# EAGLE design LibreServo-v2.3.1 (EAGLE 7.6.0)
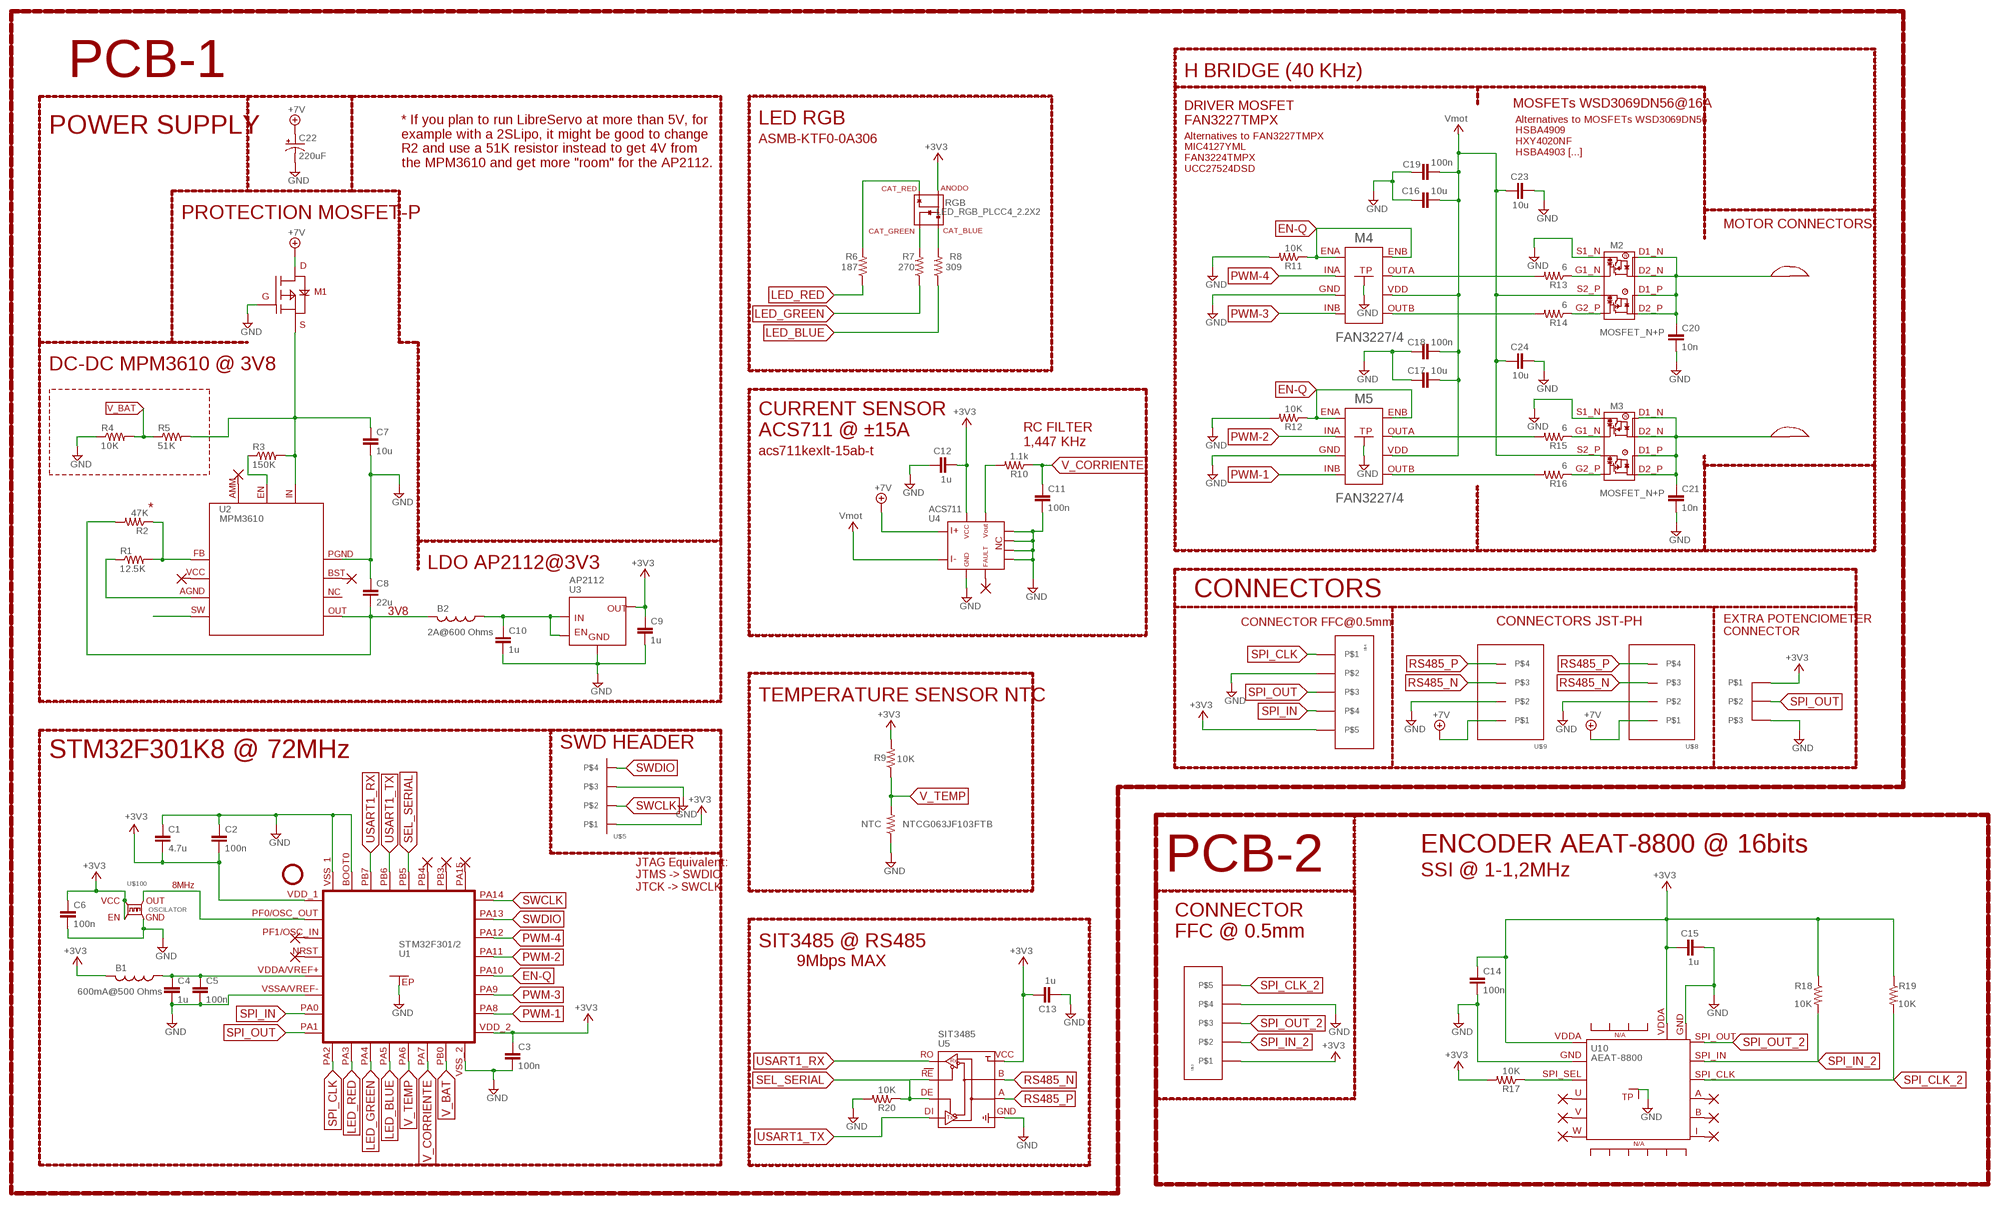
[diagram p0: schematic, sheet 1]

## Parts
B1  FERRITE_BEAD_0402  [0402]
B2  FERRITE_BEAD_0603  [0603]
C1  4.7u  C-EU0402  [0402]
C2  100n  C-EU0402  [0402]
C3  100n  C-EU0402  [0402]
C4  1u  C-EU0402  [0402]
C5  100n  C-EU0402  [0402]
C6  100n  C-EU0402  [0402]
C7  10u  C-EU0603  [0603]
C8  22u  C-EU1206  [1206]
C9  1u  C-EU0402  [0402]
C10  1u  C-EU0402  [0402]
C11  100n  C-EU0402  [0402]
C12  1u  C-EU0402  [0402]
C13  1u  C-EU0402  [0402]
C14  100n  C-EU0402  [0402]
C15  1u  C-EU0402  [0402]
C16  10u  C-EU0603  [0603]
C17  10u  C-EU0603  [0603]
C18  100n  C-EU0402  [0402]
C19  100n  C-EU0402  [0402]
C20  10n  C-EU0402  [0402]
C21  10n  C-EU0402  [0402]
C22  220uF  CPOL-USE2,5-6_MIN  [E2,5-6_MIN]
C23  10u  C-EU0603  [0603]
C24  10u  C-EU0603  [0603]
M1  M1  P5103EMA  [SOT23]
M2  MOSFET_N+P  [DFN5X6]
M3  MOSFET_N+P  [DFN5X6]
M4  FAN3227/4  FAN3227/3  [MLP8]
M5  FAN3227/4  FAN3227/3  [MLP8]
NTC  R-US0402_MIN  [0402_MIN]
R1  12.5K  R-US0402  [0402]
R2  47K  R-US0402  [0402]
R3  150K  R-US0402  [0402]
R4  10K  R-US0402  [0402]
R5  51K  R-US0402  [0402]
R6  187  R-US0402  [0402]
R7  270  R-US0402  [0402]
R8  309  R-US0402  [0402]
R9  10K  R-US0402  [0402]
R10  1.1k  R-US0402  [0402]
R11  10K  R-US0402  [0402]
R12  10K  R-US0402  [0402]
R13  6  R-US0402  [0402]
R14  6  R-US0402  [0402]
R15  6  R-US0402  [0402]
R16  6  R-US0402  [0402]
R17  10K  R-US0402  [0402]
R18  10K  R-US0402  [0402]
R19  10K  R-US0402  [0402]
R20  10K  R-US0402  [0402]
RGB  LED_RGB_PLCC4_2.2X2  [PLCC-4_2.2X2]
U1  STM32F301/2  STM32F302  [QFN32]
U2  MPM3610  MPM36XX  [MPM36XX]
U3  AP2112  [SOT25]
U4  ACS711  [ACS711-QFN]
U5  SIT3485  RS485-HALF_DUPLEX  [MSOP-8]
U10  AEAT-8800  [QFN24]
U$1  SLOT  [SERVO_SLOT]
U$2  SLOT  [SERVO_SLOT]
U$3  FFC-5  [FFC-5-0.5]
U$4  FFC-5  [FFC-5-0.5]
U$5  HEADER_4_1.27_0.3  [HEADER_4_1.27_0.3]
U$6  POTEN_SERVO  [POTEN_SERVO]
U$7  NC_MARKER  (no package)
U$8  JST_PH-4_HOLEB  [JST_PH-4_HOLE_B]
U$9  JST_PH-4_HOLEB  [JST_PH-4_HOLE_B]
U$10  NC_MARKER  (no package)
U$11  NC_MARKER  (no package)
U$12  NC_MARKER  (no package)
U$13  NC_MARKER  (no package)
U$14  NC_MARKER  (no package)
U$15  NC_MARKER  (no package)
U$16  NC_MARKER  (no package)
U$17  NC_MARKER  (no package)
U$18  NC_MARKER  (no package)
U$19  NC_MARKER  (no package)
U$20  NC_MARKER  (no package)
U$21  NC_MARKER  (no package)
U$22  NC_MARKER  (no package)
U$23  NC_MARKER  (no package)
U$100  OSCILATOR  [OSC-2X1.6]

## Nets
711_OUT: R10.2 U4.P$11
+3V3: B1.2 C1.2 C2.2 C3.1 C6.1 C9.1 C12.2 C13.2 R9.2 RGB.P$1(ANODO) U1.1(VDD_1) U1.17(VDD_2) U3.5 U4.P$12 U5.P$8 U$4.P$5 U$5.P$1 U$6.P$1 U$100.P$1(EN) U$100.P$4(VCC)
+3V3_2: C14.1 C15.1 R17.2 R18.1 R19.1 U10.P$14 U10.P$19 U$3.P$1 ; supply symbol labelled +3V3
+7V: C22.+ M1.P$2(D) U4.P$1 U$8.P$1 U$9.P$1
CLK-8MHZ: U1.2(PF0/OSC_IN) U$100.P$3(OUT)
EN-Q: M4.P$1(ENA) M4.P$8(ENB) M5.P$1(ENA) M5.P$8(ENB) R11.1 R12.1 U1.20(PA10)
GND: C1.1 C2.1 C3.2 C4.2 C5.2 C6.2 C7.2 C8.1 C9.2 C10.2 C11.2 C12.1 C13.1 C16.1 C17.1 C18.1 C19.1 C20.2 C21.2 C22.- C23.2 C24.2 M1.P$1(G) M2.P$1(S1_N) M3.P$1(S1_N) M4.P$3(GND) M4.P$9(TP) M5.P$3(GND) M5.P$9(TP) NTC.1 R4.1 R11.2 R12.2 R20.2 U1.6(VSSA/VREF-) U1.16(VSS_2) U1.31(BOOT0) U1.32(VSS_1) U1.EP U2.P$12(P$8_PGND) U2.P$13(P$8_PGND) U2.P$14(P$8_PGND) U3.2 U4.P$5 U4.P$7 U4.P$8 U4.P$9 U4.P$10 U5.P$5 U$4.P$2 U$5.P$3 U$6.P$3 U$8.P$2 U$9.P$2 U$100.P$2(GND)
GND_2: C14.2 C15.2 U10.P$13 U10.P$20 U10.P$25 U$3.P$4 ; supply symbol labelled GND
IN_AP2112: B2.1 C10.1 U3.1 U3.3
LED_BLUE: R8.1 U1.12(PA5)
LED_GREEN: R7.1 U1.11(PA4)
LED_RED: R6.1 U1.10(PA3)
M1-OUT: C7.1 M1.P$3(S) R3.2 R5.2 U2.P$16(P$9_IN)
M2-OUT: C20.1 M2.P$5(D2_P) M2.P$6(D1_P) M2.P$7(D2_N) M2.P$8(D1_N) M2.P$9(D1_N) U$1.P$1
M3-OUT: C21.1 M3.P$5(D2_P) M3.P$6(D1_P) M3.P$7(D2_N) M3.P$8(D1_N) M3.P$9(D1_N) U$2.P$1
M4-OUTA: M4.P$7(OUTA) R13.2
M4-OUTA-IN: M2.P$2(G1_N) R13.1
M4-OUTB: M4.P$5(OUTB) R14.2
M4-OUTB-IN: M2.P$4(G2_P) R14.1
M5-OUTA: M5.P$7(OUTA) R15.2
M5-OUTA-IN: M3.P$2(G1_N) R15.1
M5-OUTB: M5.P$5(OUTB) R16.2
M5-OUTB-IN: M3.P$4(G2_P) R16.1
MPM3610_AGND: R1.1 U2.P$3(P$3_AGND)
MPM3610_EN: R3.1 U2.P$17(P$10_EN)
MPM3610_FB: R1.2 R2.1 U2.P$1(P$1_FB)
MPM3610_SW: U2.P$4(P$4_SW) U2.P$5(P$4_SW) U2.P$6(P$4_SW)
N$1: R6.2 RGB.P$4(CAT_RED)
N$2: U2.P$2(P$2_VCC) U$7.P$1
N$3: U2.P$18(P$11_AMM) U$10.P$1
N$4: R7.2 RGB.P$3(CAT_GREEN)
N$5: R8.2 RGB.P$2(CAT_BLUE)
N$6: U2.P$11(P$7_BST) U$11.P$1
N$7: U1.27(PB4) U$12.P$1
N$8: U1.26(PB3) U$13.P$1
N$9: U1.25(PA15) U$14.P$1
N$10: U1.3(PF1/OSC_OUT) U$15.P$1
N$11: U1.4(NRST) U$16.P$1
N$12: U10.P$22 U$17.P$1
N$13: U10.P$23 U$18.P$1
N$14: U10.P$24 U$19.P$1
N$15: U10.P$7 U$20.P$1
N$16: U10.P$8 U$21.P$1
N$17: R17.1 U10.P$21
N$18: U10.P$9 U$22.P$1
N$19: U4.P$6 U$23.P$1
OUT_MPM3610: B2.2 C8.2 R2.2 U2.P$7(P$5_OUT) U2.P$8(P$5_OUT) U2.P$9(P$5_OUT)
PWM-1: M5.P$4(INB) U1.18(PA8)
PWM-2: M5.P$2(INA) U1.21(PA11)
PWM-3: M4.P$4(INB) U1.19(PA9)
PWM-4: M4.P$2(INA) U1.22(PA12)
RS485_N [Diff]: U5.P$7 U$8.P$3 U$9.P$3
RS485_P [Diff]: U5.P$6 U$8.P$4 U$9.P$4
SEL_SERIAL: R20.1 U1.28(PB5) U5.P$2 U5.P$3
SPI_CLK: U1.9(PA2) U$4.P$1
SPI_CLK_2: R19.2 U10.P$10 U$3.P$5
SPI_IN: U1.7(PA0) U$4.P$4
SPI_IN_2: R18.2 U10.P$11 U$3.P$2
SPI_OUT: U1.8(PA1) U$4.P$3 U$6.P$2
SPI_OUT_2: U10.P$12 U$3.P$3
SWCLK: U1.24(PA14) U$5.P$2
SWDIO: U1.23(PA13) U$5.P$4
USART1_RX: U1.30(PB7) U5.P$1
USART1_TX: U1.29(PB6) U5.P$4
V_BAT: R4.2 R5.1 U1.15(PB0)
V_CORRIENTE: C11.1 R10.1 U1.14(PA7)
V_TEMP: NTC.2 R9.1 U1.13(PA6)
VDDA-FILTRADO: B1.1 C4.1 C5.1 U1.5(VDDA/VREF+)
VMOT: C16.2 C17.2 C18.2 C19.2 C23.1 C24.1 M2.P$3(S2_P) M3.P$3(S2_P) M4.P$6(VDD) M5.P$6(VDD) U4.P$3 ; supply symbol labelled Vmot
Unconnected: U2.P$10(P$6_NC) U2.P$15(P$6_NC) U10.P$1 U10.P$2 U10.P$3 U10.P$4 U10.P$5 U10.P$6 U10.P$15 U10.P$16 U10.P$17 U10.P$18 U$1.P$2 U$2.P$2

## Notes on the sheet
- PCB-1 | H BRIDGE (40 KHz)
- MOSFETs WSD3069DN56@16A
- LED RGB
- DRIVER MOSFET
  FAN3227TMPX
- POWER SUPPLY
- ASMB-KTF0-0A306
- Alternatives to MOSFETs WSD3069DN56
  HSBA4909
  HXY4020NF
  HSBA4903 [...]
- * If you plan to run LibreServo at more than 5V, for
  example with a 2SLipo, it might be good to change
  R2 and use a 51K resistor instead to get 4V from
  the MPM3610 and get more "room" for the AP2112.
- Alternatives to FAN3227TMPX
  MIC4127YML
  FAN3224TMPX
  UCC27524DSD
- PROTECTION MOSFET-P
- MOTOR CONNECTORS
- M1
- DC-DC MPM3610 @ 3V8
- CURRENT SENSOR
  ACS711 @ ±15A
- RC FILTER
  1,447 KHz
- acs711kexlt-15ab-t
- *
- LDO AP2112@3V3
- CONNECTORS
- 3V8
- CONNECTOR FFC@0.5mm | CONNECTORS JST-PH
- 2A@600 Ohms
- EXTRA POTENCIOMETER
  CONNECTOR
- TEMPERATURE SENSOR NTC
- SWD HEADER
- STM32F301K8 @ 72MHz
- NTCG063JF103FTB
- ENCODER AEAT-8800 @ 16bits
- PCB-2 | SSI @ 1-1,2MHz
- 8MHz
- JTAG Equivalent:
  JTMS -> SWDIO
  JTCK -> SWCLK
- CONNECTOR
  FFC @ 0.5mm
- SIT3485 @ RS485
- 9Mbps MAX
- 600mA@500 Ohms

## Library data of the parts
B1 = Propio:FERRITE_BEAD_0402
B2 = Propio:FERRITE_BEAD_0603
C1-C21 C23 C24 = Propio:C-EU
C22 = rcl:CPOL-US: POLARIZED CAPACITOR, American symbol
M1 = Propio:P5103EMA
M2 M3 = Propio:MOSFET_N+P
M4 M5 = Propio:FAN3227/3
NTC R1-R20 = Propio:R-US
RGB = Propio:LED_RGB_PLCC4_2.2X2
U1 = Propio:STM32F302
U2 = Propio:MPM36XX
U3 = Propio:AP2112
U4 = Propio:ACS711
U5 = Propio:RS485-HALF_DUPLEX
U10 = Propio:AEAT-8800
U$1 U$2 = Propio:SLOT
U$3 U$4 = Propio:FFC-5
U$5 = Propio:HEADER_4
U$6 = Propio:POTEN_SERVO
U$7 U$10-U$23 = NC_MARKER:NC_MARKER
U$8 U$9 = Propio:JST_PH-4_HOLE
U$100 = Propio:OSCILATOR

## Net classes
1 Diff: width 0.178 mm, clearance 0.152 mm

## Board
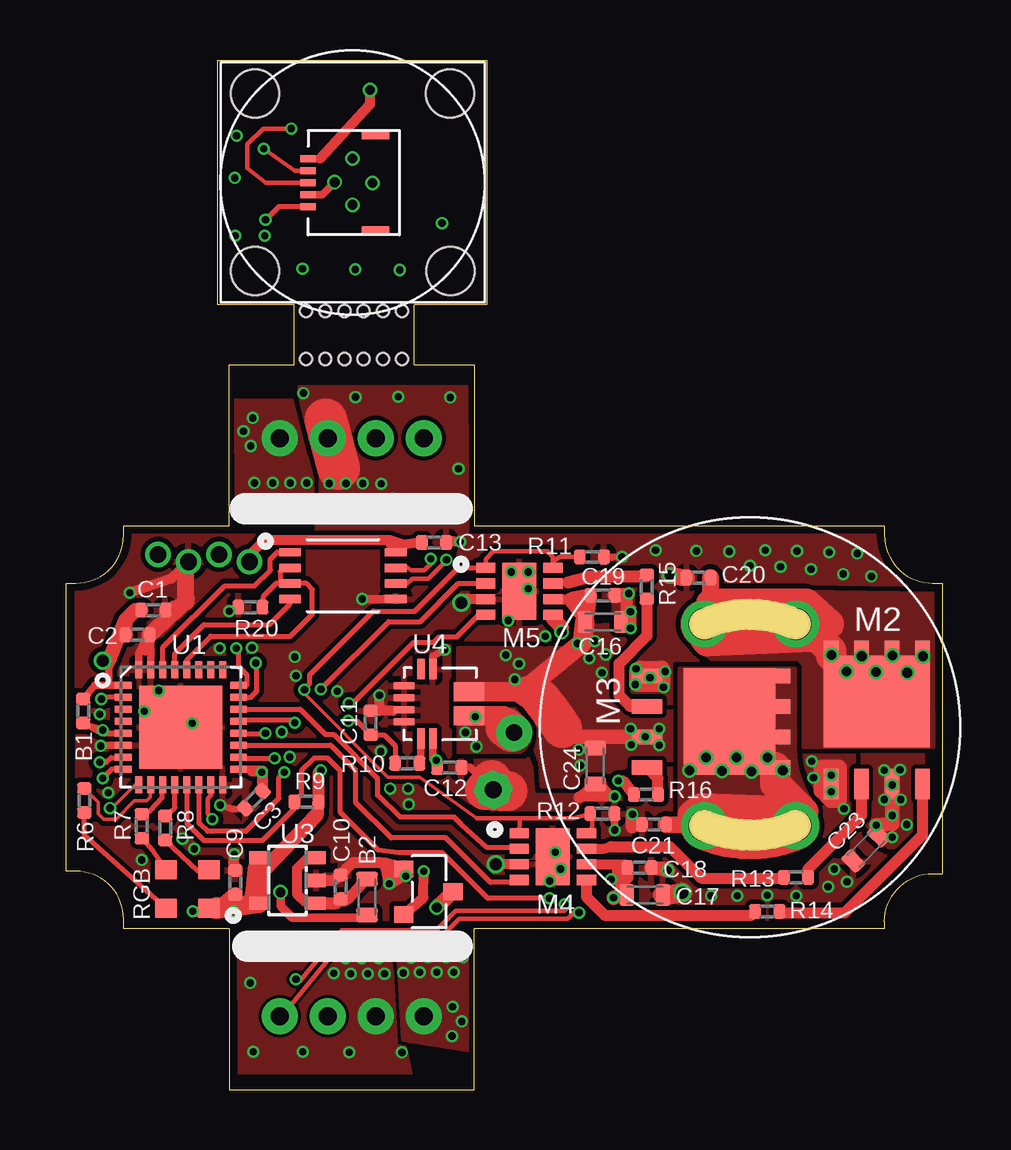
[diagram p1: board, top side]
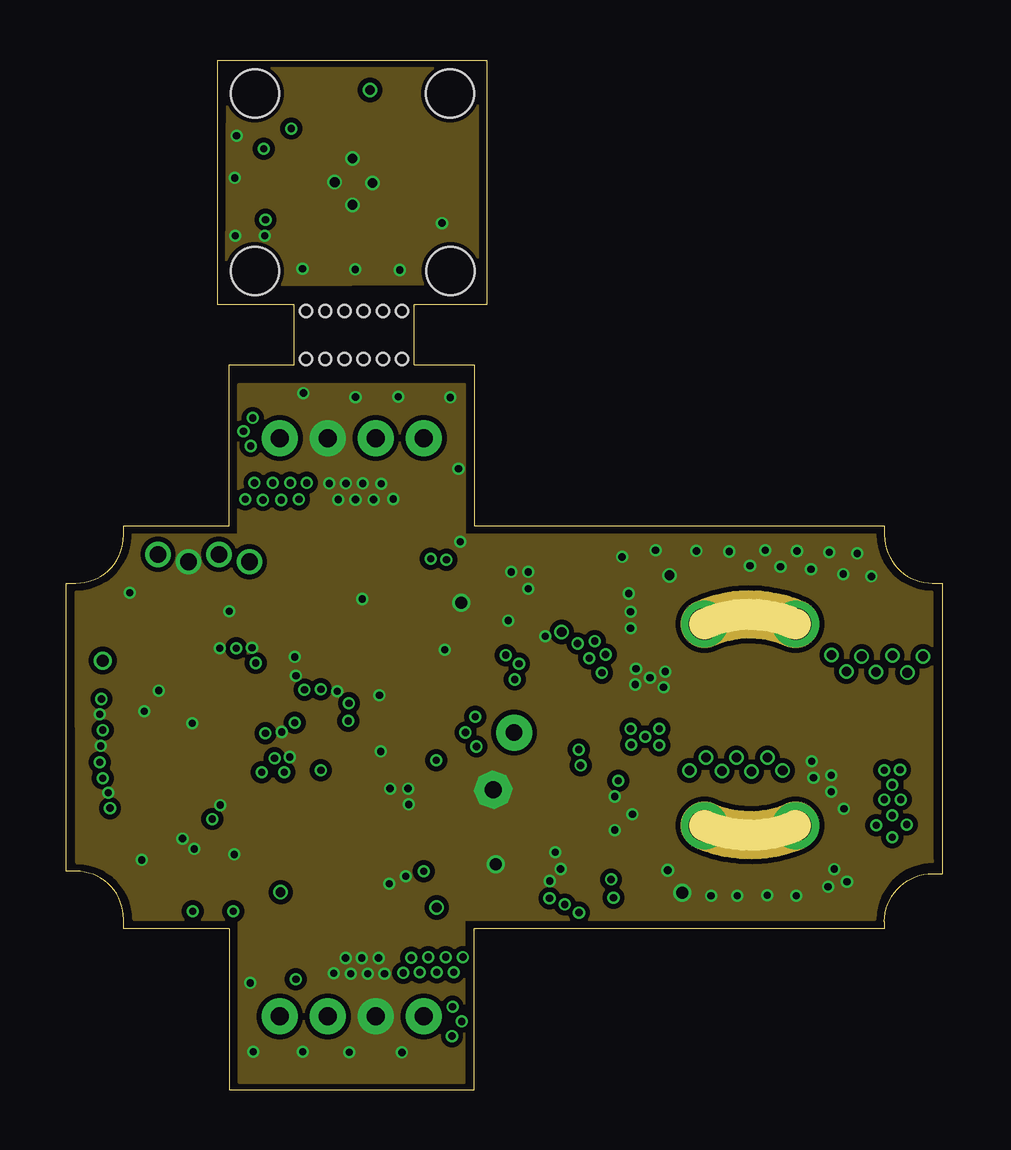
[diagram p2: board, inner layer Route2]
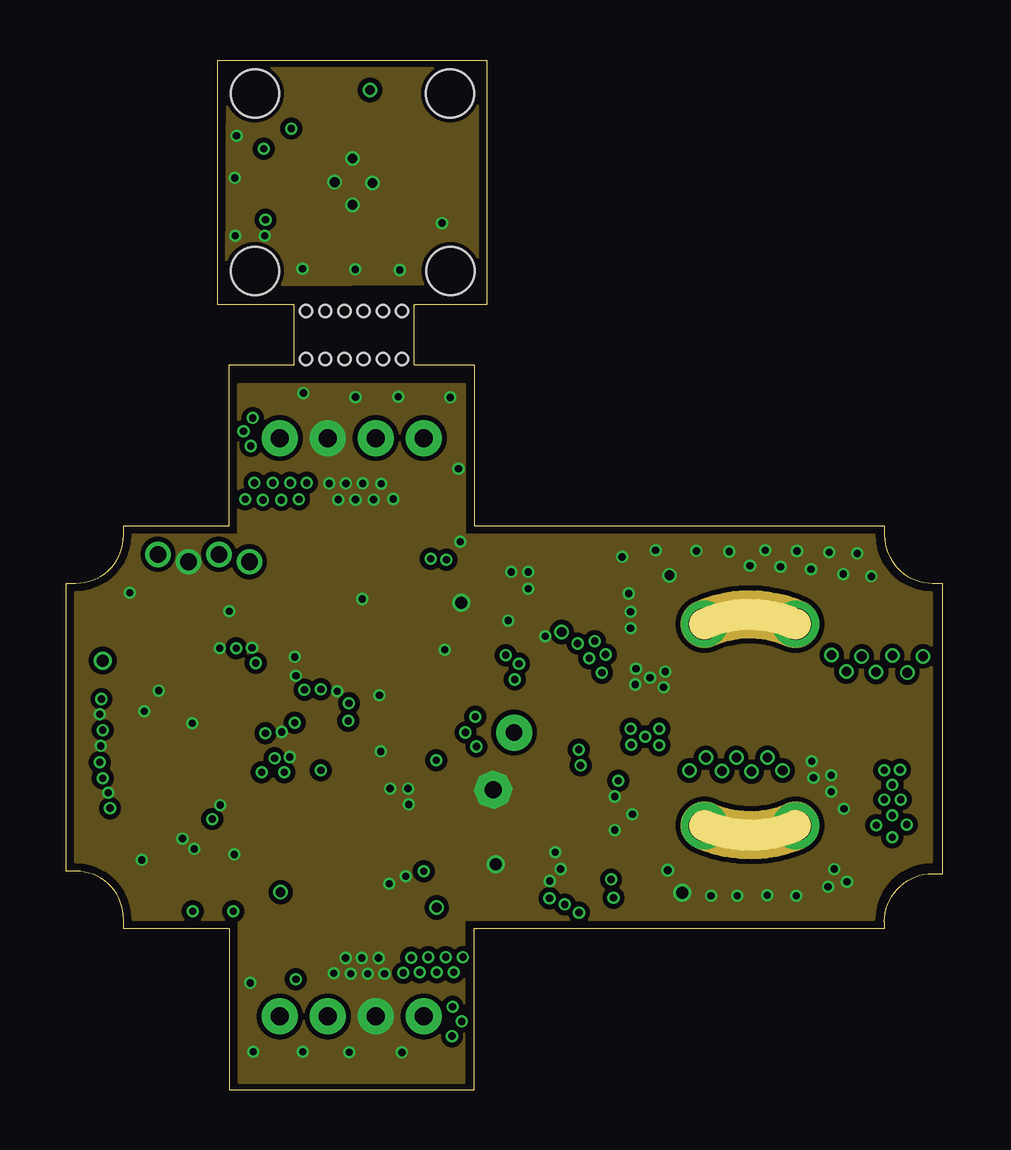
[diagram p3: board, inner layer Route3]
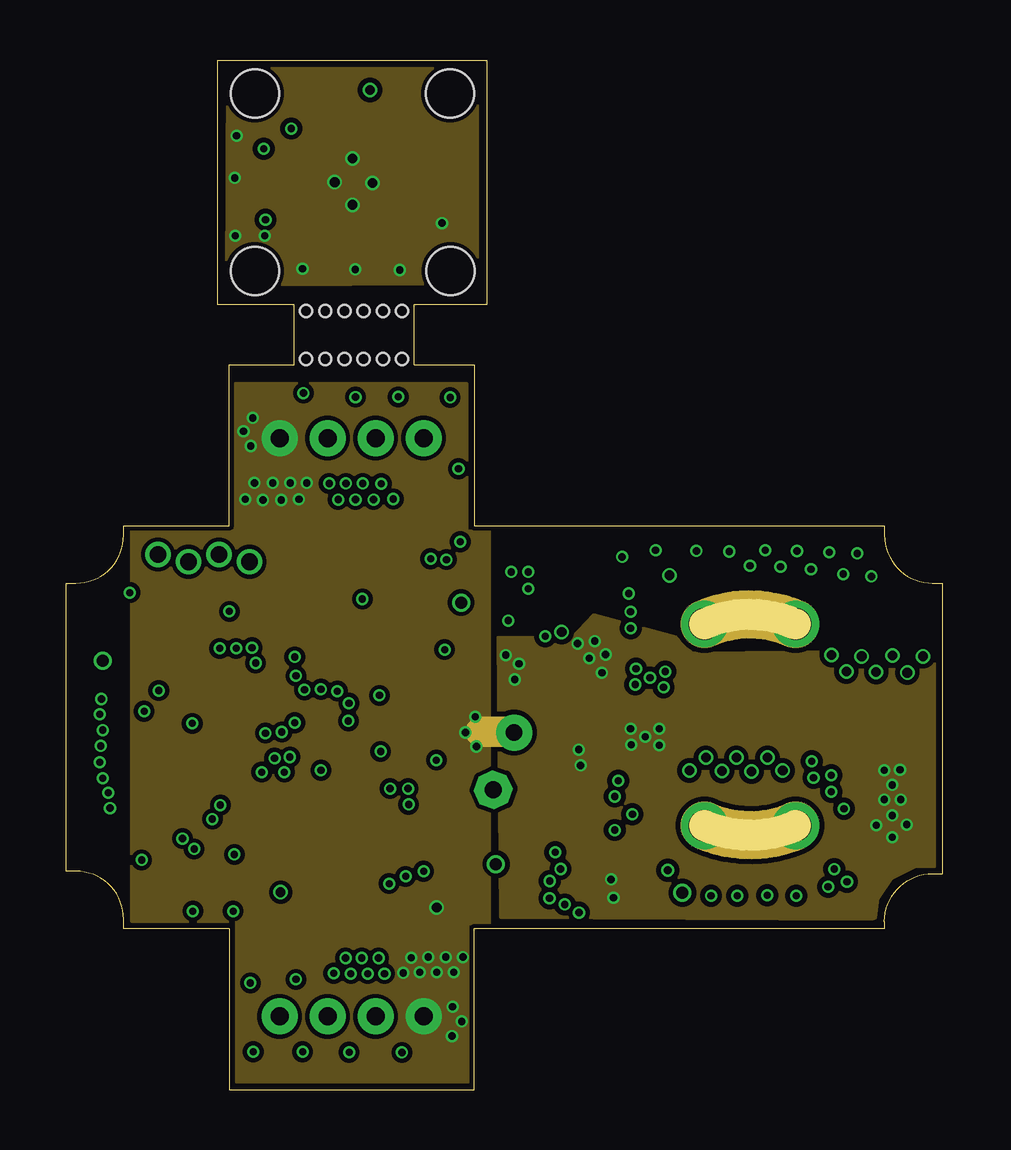
[diagram p4: board, inner layer Route14]
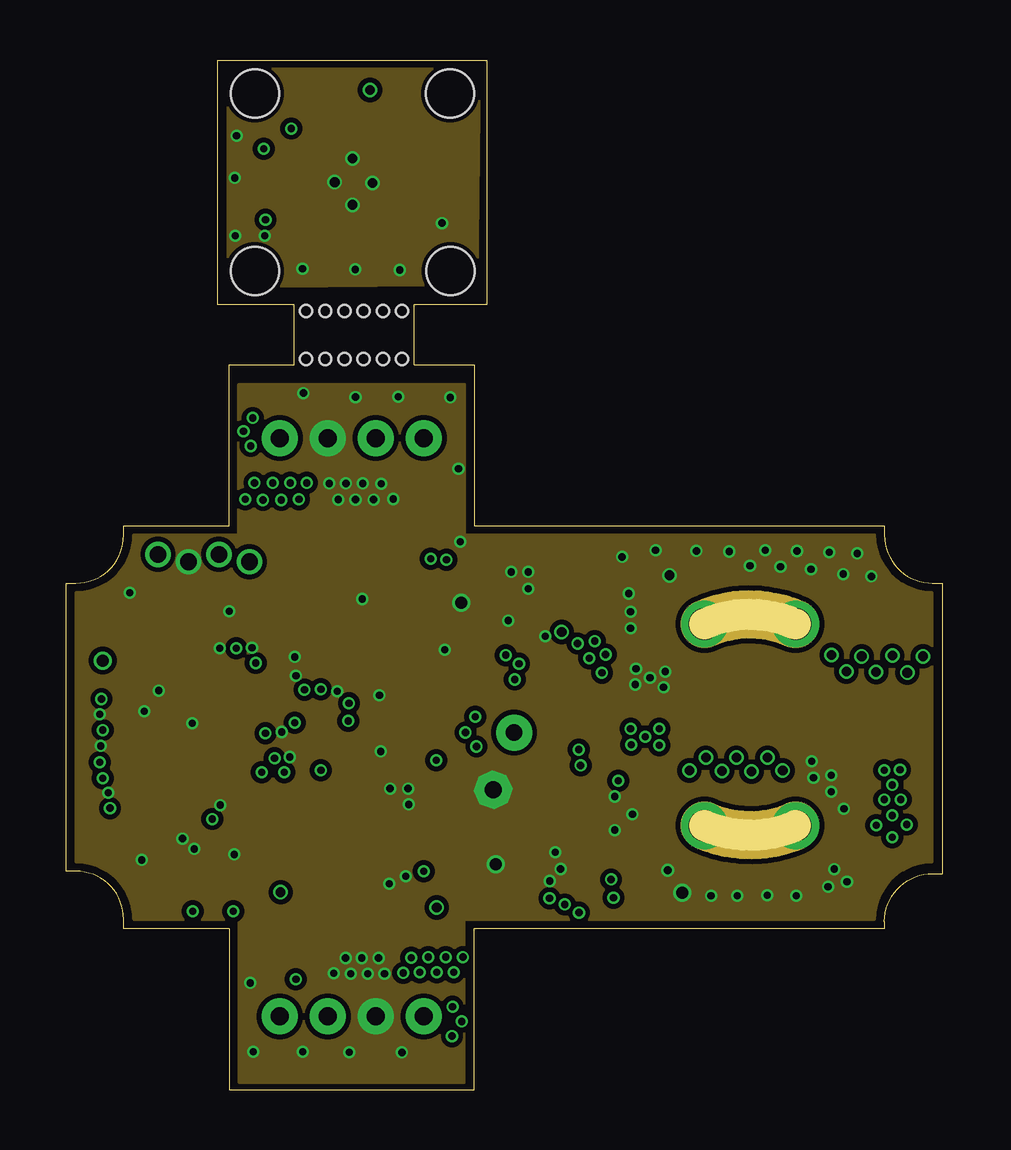
[diagram p5: board, inner layer Route15]
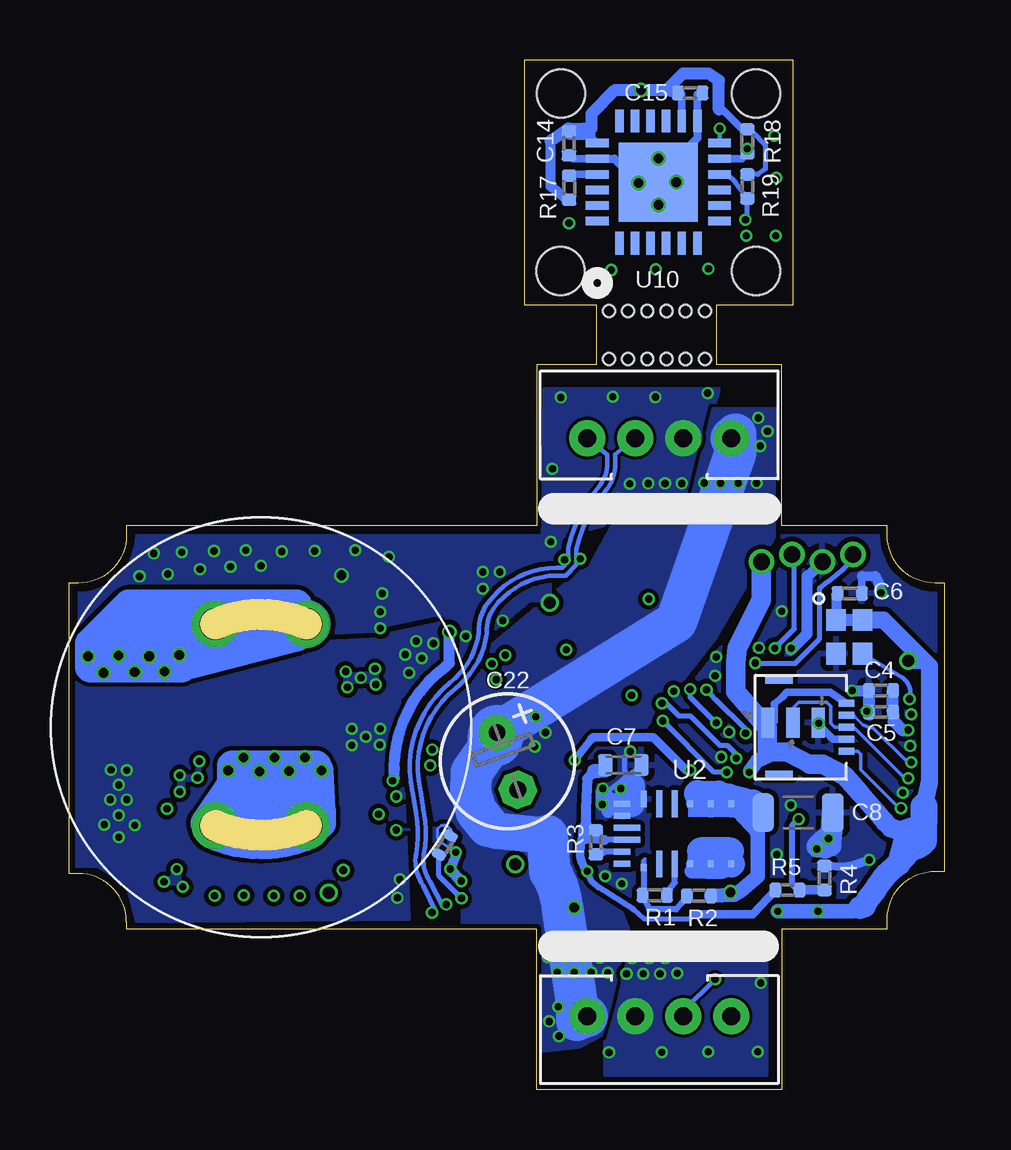
[diagram p6: board, bottom side, seen from below]

Size 36.5 x 42.9 mm. Coordinates in mm from the lower left corner, seen from the top.
Outline: 2.4,7.1 arc90 0.4,9.1 0,9.1 0,21.1 0.4,21.1 arc90 2.4,23.1 2.4,23.5 6.8,23.5 6.8,30.2 9.5,30.2 9.5,32.7 6.33,32.7 6.33,42.9 17.53,42.9 17.53,32.7 14.5,32.7 14.5,30.2 17,30.2 17,23.5 34.1,23.5 34.1,23.1 arc90 36.1,21.1 36.5,21.1 36.5,9 36.1,9 arc90 34.1,7 34.1,6.7 17,6.7 17,0 6.8,0 6.8,6.7 2.4,6.7 2.4,7.1
Copper layers (1+2*3+14*15+16): Top 0.035mm / dielectric 0.0994mm / Route2 0.0152mm / dielectric 0.3196mm / Route3 0.0152mm / dielectric 0.1088mm / Route14 0.0152mm / dielectric 0.3196mm / Route15 0.0152mm / dielectric 0.0994mm / Bottom 0.035mm
Design rules "jlcpcb_6_layer *": minimum track width 5mil, minimum drill 0.3mm, track to track 0.126490625mm, track to pad 0.126490625mm, pad to pad 0.126490625mm, via to via 0.126490625mm, smd to smd 0mil, copper to edge 0.2mm, drill to drill 5mil, minimum pad ring 4mil, minimum via ring 4mil, stop-mask expansion 3mil, vias tented up to drill 100mil, thermal gap 10mil
Holes 2 mm at 7.87,34.11 7.87,41.5 15.99,41.5 16.02,34.11
Holes 0.5 mm at 10,30.45 10.8,30.45 11.6,30.45 12.4,30.45 13.2,30.45 14,30.45 10,32.45 10.8,32.45 11.6,32.45 12.4,32.45 13.2,32.45 14,32.45

### Footprints (pad centres in the part's own frame; a part is rotated, then mirrored left to right if it is on the bottom)
0402 = smd 0.5 x 0.6: 1 -0.5,0; 2 0.5,0
0603 = smd 0.6 x 0.9: 1 -0.75,0; 2 0.75,0
1206 = smd 0.9 x 1.6: 1 -1.45,0; 2 1.45,0
E2,5-6_MIN = drill 0.7 pad 1.5: + -1.27,0 | drill 0.7 pad 1.5 octagon: - 1.27,0
SOT23 = smd 0.7 x 0.8: P$1 -0.95,-1.25; P$2 0,0.8; P$3 0.95,-1.25
DFN5X6 = smd 0.61 x 1.27: P$1 0,0; P$2 1.27,0; P$3 2.54,0; P$4 3.81,0; P$5 3.81,5.34; P$6 2.54,5.34; P$7 1.27,5.34; P$8 0,5.34 | smd 4.42 x 3.81: P$9 1.9,3.45
MLP8 = smd 0.8 x 0.42: P$1 -1.4,0.975; P$2 -1.4,0.325; P$3 -1.4,-0.325; P$4 -1.4,-0.975; P$5 1.4,-0.975; P$6 1.4,-0.325; P$7 1.4,0.325; P$8 1.4,0.975 | smd 1.42 x 2.37: P$9 0,0
0402_MIN = smd 0.4 x 0.6: 1 -0.45,0; 2 0.45,0
PLCC-4_2.2X2 = smd 0.9 x 0.8: P$1 -0.9,0.8; P$2 -0.9,-0.8; P$3 0.9,-0.8; P$4 0.9,0.8
QFN32 = smd 0.3 x 0.7: 1 -1.75,-2.4; 2 -1.25,-2.4; 3 -0.75,-2.4; 4 -0.25,-2.4; 5 0.25,-2.4; 6 0.75,-2.4; 7 1.25,-2.4; 8 1.75,-2.4; 17 1.75,2.4; 18 1.25,2.4; 19 0.75,2.4; 20 0.25,2.4; 21 -0.25,2.4; 22 -0.75,2.4; 23 -1.25,2.4; 24 -1.75,2.4 | smd 0.7 x 0.3: 9 2.4,-1.75; 10 2.4,-1.25; 11 2.4,-0.75; 12 2.4,-0.25; 13 2.4,0.25; 14 2.4,0.75; 15 2.4,1.25; 16 2.4,1.75; 25 -2.4,1.75; 26 -2.4,1.25; 27 -2.4,0.75; 28 -2.4,0.25; 29 -2.4,-0.25; 30 -2.4,-0.75; 31 -2.4,-1.25; 32 -2.4,-1.75 | smd 3.45 x 3.45: EP 0,0
MPM36XX = smd 0.3 x 0.25: P$1 -1.4,1.55; P$4 -1.25,-0.4; P$5 -1.25,-1.25; P$6 -1.25,-2.1; P$7 1.25,-2.1; P$8 1.25,-1.25; P$9 1.25,-0.4 | smd 1.1 x 0.25: P$2 -1.25,0.9; P$3 -1.25,0.25 | smd 1.125 x 0.25: P$10 1.25,0.25; P$11 1.25,0.9 | smd 0.7 x 0.25: P$12 1.45,1.55 | smd 0.25 x 0.7: P$13 1.25,2.45; P$14 0.75,2.45; P$17 -0.75,2.45; P$18 -1.25,2.45 | smd 0.25 x 1.1: P$15 0.25,2.25; P$16 -0.25,2.25
SOT25 = smd 0.55 x 0.8: 1 -0.95,-1.2; 2 0,-1.2; 3 0.95,-1.2; 4 0.95,1.2; 5 -0.95,1.2
ACS711-QFN = smd 1.27 x 0.8: P$1 0,0.5; P$3 0,-0.5 | smd 0.3 x 0.85: P$5 1.5,-1.45; P$6 2,-1.45; P$11 2,1.45; P$12 1.5,1.45 | smd 0.85 x 0.3: P$7 2.7,-0.75; P$8 2.7,-0.25; P$9 2.7,0.25; P$10 2.7,0.75
MSOP-8 = smd 0.9 x 0.35: P$1 -2.2,0.975; P$2 -2.2,0.325; P$3 -2.2,-0.325; P$4 -2.2,-0.975; P$5 2.2,-0.975; P$6 2.2,-0.325; P$7 2.2,0.325; P$8 2.2,0.975
QFN24 = smd 0.95 x 0.35: P$1 -2.55,1.625; P$2 -2.55,0.975; P$3 -2.55,0.325; P$4 -2.55,-0.325; P$5 -2.55,-0.975; P$6 -2.55,-1.625; P$13 2.55,-1.625; P$14 2.55,-0.975; P$15 2.55,-0.325; P$16 2.55,0.325; P$17 2.55,0.975; P$18 2.55,1.625 | smd 0.35 x 0.95: P$7 -1.625,-2.55; P$8 -0.975,-2.55; P$9 -0.325,-2.55; P$10 0.325,-2.55; P$11 0.975,-2.55; P$12 1.625,-2.55; P$19 1.625,2.55; P$20 0.975,2.55; P$21 0.325,2.55; P$22 -0.325,2.55; P$23 -0.975,2.55; P$24 -1.625,2.55 | smd 3.3 x 3.3: P$25 0,0
SERVO_SLOT = drill 1.3: P$1 -1.9,4.2; P$2 1.9,4.2
FFC-5-0.5 = smd 0.3 x 0.65: P$1 -1,0; P$2 -0.5,0; P$3 0,0; P$4 0.5,0; P$5 1,0 | smd 0.3 x 1.15: P$6 -1.96,2.81; P$7 1.96,2.81
HEADER_4_1.27_0.3 = drill 0.7 pad 1.016: P$1 -2.54,0; P$2 -1.27,0.3; P$3 0,0; P$4 1.27,0.3
POTEN_SERVO = smd 0.55 x 1.27: P$1 -1.05,0; P$2 0,0; P$3 1.05,0
JST_PH-4_HOLE_B = drill 0.75 pad 1.5: P$1 -3,0; P$2 -1,0; P$3 1,0; P$4 3,0
OSC-2X1.6 = smd 0.8 x 0.9: P$1 -0.55,0.7; P$2 -0.55,-0.7; P$3 0.55,-0.7; P$4 0.55,0.7

### Placement (x,y rotation side)
B1  0.71,15.77 90 top
B2  12.54,8.03 270 top
C1  3.64,19.98 180 top
C2  2.98,18.95 180 top
C3  7.82,12.08 225 top
C4  2.67,16.63 180 bottom
C5  2.67,15.73 180 bottom
C6  3.96,20.67 0 bottom
C7  13.39,13.52 0 bottom
C8  6.12,11.54 180 bottom
C9  7.05,8.63 90 top
C10  11.44,8.44 90 top
C11  12.69,15.28 90 top
C12  15.96,13.42 180 top
C13  15.33,22.8 180 top
C14  15.66,39.44 270 bottom
C15  10.61,41.52 0 bottom
C16  22.37,19.48 180 top
C17  24.12,8.11 180 top
C18  23.89,9.25 180 top
C19  22.36,20.59 180 top
C20  26.35,21.33 180 top
C21  24.5,11.05 180 top
C22  18.23,13.68 290 bottom
C23  33.32,10.05 225 top
C24  22.05,13.48 270 top
M1  15.32,8.24 270 top
M2  31.88,12.73 0 top
M3  24.2,17.24 270 top
M4  20.29,9.71 0 top
M5  18.89,20.76 0 top
NTC  20.84,10.19 238 bottom
R1  12.09,8.1 180 bottom
R2  10.24,8.07 0 bottom
R3  14.54,10.3 90 bottom
R4  5.02,8.82 270 bottom
R5  6.56,8.31 180 bottom
R6  0.76,12.05 270 top
R7  3.16,10.98 270 top
R8  4.13,10.9 270 top
R9  10.01,11.99 0 top
R10  14.21,13.6 0 top
R11  21.91,22.2 0 top
R12  22.34,11.5 0 top
R13  30.41,8.84 180 top
R14  29.21,7.43 180 top
R15  24.2,20.95 90 top
R16  24.16,12.29 180 top
R17  15.65,37.58 270 bottom
R18  8.23,39.51 270 bottom
R19  8.23,37.63 270 bottom
R20  7.68,20.1 180 top
RGB  5.06,8.35 180 top
U1  4.78,15.1 270 top
U2  11,10.66 90 bottom
U3  9.22,8.71 90 top
U4  16.79,16.07 180 top
U5  11.54,21.42 0 top
U10  11.94,37.81 90 bottom
U$1  28.5,15.2 0 top
U$2  28.5,15.2 180 top
U$3  10.09,37.79 270 top
U$4  4.1,15.1 90 bottom
U$5  5.1,22 0 bottom
U$6  6.32,15.29 0 bottom
U$8  11.9,3.05 180 top
U$9  11.9,27.15 0 top
U$100  3.98,18.86 0 bottom

### Tracks (layer width: path | path; a pad name or v marks a point on that pad's centre or on a via)
711_OUT
  Top 0.305: U4.P$11 14.79,13.78 R10.2
+3V3  (via drill 0.3, 0.5)
  Top 0.203: 15.29,14.88 15.29,13.85 v15.43,13.73
  Top 0.254: 7.68,13.35 8.03,13.35 v8.15,13.23
  Top 0.305: B1.2 1.19,16.85 1.78,16.85 | 1.78,16.85 U1.1 | C12.2 15.29,13.78 | 15.29,13.78 U4.P$12 | U1.17 7.68,13.35 7.75,13.28 | 15.29,13.78 15.37,13.72 v15.43,13.73 | 1.78,16.85 1.78,17.55 1.96,17.9 v1.52,17.88
  Top 0.356: 13.89,22.68 U5.P$8 13.39,22.89
  Top 0.406: 2.41,19.45 C2.2 | 1.7,17.82 1.83,17.98 | C13.2 13.89,22.68 | U$5.P$1 7.64,22.27 8.28,22.9 13.46,22.9 14.1,22.7 13.39,22.89
  Top 0.457: 7.75,13.28 8.18,13.28 C3.1 | RGB.P$1 5.95,7.58 arc-90 v6.96,7.44 6.12,7.36 v5.28,7.44 | U3.5 7.9,7.86
  Top 0.508: R9.2 10.49,11.56 | v10.62,13.3 10.52,13.2 R9.2 | 10.41,11.42 10.49,11.47 R9.2
  Top 0.61: 1.83,17.98 2.41,19.45 | v1.52,17.88 1.7,17.82 | 6.27,7.51 C9.1 | C1.2 2.89,19.98 2.46,19.55 2.46,18.96 C2.2 | 8.03,9.16 8.26,9.16 10.41,11.42
  Top 0.66: 6.27,7.61 v6.96,7.44
  Top 0.813: U3.5 6.27,7.51 6.27,7.61
  Top 0.914: 7.9,7.86 8.03,9.16
  Bottom 0.203: 1.64,10.45 1.86,10.67 2.02,10.84
  Bottom 0.305: 8.18,13.25 v8.15,13.23 | v15.43,13.73 14.76,14.57 | U$6.P$1 7.11,15.35 7.11,16.07 6.78,16.35 6.58,16.55 4.78,16.55 U$4.P$5
  Bottom 0.356: 14.76,14.57 14.66,14.68 12.14,14.68 10.77,13.3 v10.62,13.3
  Bottom 0.406: C6.1 4.53,20.6 U$100.P$1
  Bottom 0.457: v8.15,13.23 8.1,13.28
  Bottom 0.508: U$100.P$4 U$100.P$1
  Bottom 0.559: 7.41,15.07 U$6.P$1 | 7.16,13.99 7.41,14.08
  Bottom 0.61: v6.96,7.44 3.81,7.44 3.53,7.59 | 8.1,13.28 7.82,13.71 7.16,13.99 | 1.27,11.09 2.02,10.84 1.91,10.79
  Bottom 0.711: 0.86,11.8 0.64,12.82 0.64,17.65 0.86,17.88 | 0.86,17.88 v1.52,17.88 | 0.86,17.88 2.55,19.56 U$100.P$4
  Bottom 0.762: 5.64,13.56 6.58,14.07
  Bottom 0.813: 5.64,13.56 5.08,13.56 4.17,13.07 3.53,12.34 2.52,11.17 2.26,10.92 1.91,10.79 | 6.58,14.07 7.41,14.08 7.41,15.07 8.71,16.58 8.71,17.8 8.66,18.41 7.64,20.39 U$5.P$1
  Bottom 0.9: 1.92,9.4 1.21,10.14
  Bottom 0.965: 1.64,10.45 1.92,9.4 arc-27 2.82,8.45 arc15 3.15,8.02 3.35,7.64 3.53,7.59
  Bottom 1.118: 1.21,10.14 0.89,10.36 0.86,11.8
+3V3_2  (via drill 0.4)
  Top 0.305: U$3.P$1 10.57,38.79
  Top 0.406: 10.57,38.79 12.65,41.05 12.67,41.05 v12.67,41.65
  Bottom 0.203: R19.1 7.8,38.13 7.48,38.37 7.48,39.36 8.04,39.91 8.11,39.89 R18.1 8.26,40.04 8.47,40.04
  Bottom 0.305: U10.P$14 10.96,41.48 C15.1 | 14.99,39.94 U10.P$19 14.72,39.67 14.72,40.04 | R17.2 15.75,37.08 | 15.69,40.04 C14.1 | 8.47,40.04 9.26,40.83 9.41,40.83
  Bottom 0.406: 15.75,37.08 16.43,37.63 16.43,39.54
  Bottom 0.508: 16.43,39.54 15.69,40.04 | 14.72,40.04 14.72,40.65 13.72,41.65 v12.67,41.65 11.59,41.65 | 11.59,41.65 C15.1 | 9.41,40.83 9.41,42.05 9.85,42.33 10.91,42.33 11.59,41.65
  Bottom 0.711: C14.1 14.99,39.94
+7V  (via drill 0.3, 0.4)
  Top 0.61: M1.P$2 | M1.P$2 v15.44,7.59
  Top 0.762: 18.29,15.11 17.92,15.57
  Top 0.813: 18.24,15.57 17.92,15.57 U4.P$1
  Top 1.524: C22.+ 18.56,14.88
  Top 1.651: 18.56,14.88 18.29,15.11
  Route14 1.27: 18.47,14.9 17.27,14.9
  Bottom 0.203: 16.46,9.09 16.59,8.5 16.2,8.33
  Bottom 0.61: v15.44,7.59 16.2,8.33
  Bottom 1.016: 18.69,10.79 19.02,10.97
  Bottom 1.524: 16.56,10.59 18.69,10.79
  Bottom 1.727: U$9.P$1 8.71,27.3 8.71,26.55 11.2,19.5 C22.+ | U$8.P$1 15.34,2.9 15.34,3.64 15.95,7.64 arc-28 16.46,9.09 16.56,10.59 | 19.02,10.97 19.53,11.6 19.76,12.39 19.74,13.2 18.75,14.6
  Bottom 2.286: 18.75,14.6 C22.+
  other vias: 15.09,5.52 15.82,5.52 16.54,5.52 7.47,24.59 8.96,24.57 9.7,24.59 8.2,24.57 7.77,27.99 7.7,26.82 14.38,5.5 16.1,3.45 16.08,2.23 7.39,27.43 16.48,2.84 16.15,4.89 15.44,4.89 14.05,4.86 14.73,4.89 7.85,25.28 8.61,25.28 9.35,25.28 10.03,25.28 17.04,15.54 16.64,14.88 17.1,14.29
  pour Bottom (isolate 0.178, no thermals): 7.09,28.39 9.64,28.36 10.64,24.23 13.77,23.65 14.67,22.03 22.05,15.91 21.21,11.19 20.4,9.47 20.52,8.53 20.09,8.1 20.12,7.08 20.12,6.95 16.99,6.95 16.84,6.86 16.81,1.62 16.56,1.62 15.24,1.77 14.33,2.26 13.97,3.48 13.39,5.99 13.16,6.32 13.21,6.75 13.46,7.39 15.37,9.47 15.01,12.8 15.39,13.96 14.88,14.88 12.65,14.85 9.65,18.69 7.11,23.03
  pour Route14 (isolate 0.178, no thermals): 7.04,29.42 7.04,23.29 2.72,23.29 2.72,7 7.09,7 7.09,0.32 16.76,0.32 16.76,6.9 17.65,6.9 17.65,23.26 16.71,23.26 16.71,29.42
  pour Top (no thermals): 16.33,15.87 16.33,14.04 18.95,14.07 19.15,14.22 19.3,14.52 19.35,14.85 19.2,15.31 18.67,15.89
  pour Top (isolate 0.203, no thermals): 14.01,2.05 16.79,1.62 16.74,5.84 13.8,5.84
  pour Top (isolate 0.203, no thermals): 7.06,28.75 9.41,28.75 9.98,26.46 10.29,25.8 10.27,24.23 7.09,24.23
CLK-8MHZ  (via drill 0.3)
  Top 0.203: U1.2 1.62,16.35 v1.47,16.28
  Bottom 0.178: v1.47,16.28 arc-31 1.45,16.66 arc-44 1.8,17.19 U$100.P$3
EN-Q  (via drill 0.3)
  Top 0.152: 9.8,16.53 v9.93,16.66 9.93,16.5 13.41,13.03 14.73,13.03 17.12,11.3
  Top 0.178: M5.P$1 17.48,22.1 17.8,22.42 20.07,22.42 20.29,22.2 M5.P$8 arc-90 20.61,22.2 R11.1 | 18.89,10.62 18.9,11.29 | 18.9,11.29 18.9,11.3 21.16,11.3 R12.1 | 17.12,11.3 18.9,11.3 18.9,11.29 | 21.92,11.4 21.92,10.92 M4.P$8
  Top 0.203: U1.20 7.2,14.83 8.28,14.83 v8.31,14.85 | M5.P$1 16.33,21.74 14.53,19.93 12.8,19.93 10.13,17.27 10.13,16.91 v9.93,16.66
  Top 0.305: M4.P$1 18.89,10.62 | R12.1 21.92,11.4
  Bottom 0.203: v9.93,16.66 9.55,16.25 8.31,15.01 v8.31,14.85
GND  (via drill 0.3, 0.35, 0.4, 0.5)
  Top 0.127: M5.P$9 19.25,20.76 v19.25,20.87 | M4.P$9 20.48,9.78 v20.38,9.89
  Top 0.152: U1.EP 5.1,15.1 v5.26,15.26
  Top 0.203: C3.2 6.97,11.65 v6.43,11.86 7.44,11.63 | M3.P$1
  Top 0.279: 23.37,20.59 v23.44,20.67
  Top 0.305: U1.31 3.53,18.66 | 3.53,18.66 3.3,18.39 | U1.32 3.03,18.17 3.17,18.49 3.45,18.33 3.53,18.66 | 12.94,15.78 C11.2 | U1.6 1.83,14.35 v1.45,14.32 | U4.P$5 15.29,18.05 v15.77,18.33 | R11.2 22.76,22.19 v23.16,22.19 | M1.P$1 13.46,8.48 v14.15,8.88 | C12.1 16.84,13.42 C22.- | R12.2 22.84,11.44 v22.86,10.82 | 17.45,12.49 17.69,12.49 C22.- | 17.91,12.59 17.69,12.59 C22.-
  Top 0.356: C9.2 7,9.38 | v12.35,20.44 U5.P$5
  Top 0.406: C13.1 16.12,22.85 v16.42,22.83 | 12.94,15.78 13.07,15.78 v13.06,16.43 | M5.P$3 16.72,20.44 | 13.63,15.78 C11.2 | M4.P$3 17.99,9.39 v17.91,9.39 | v6.8,19.93 6.96,19.99 R20.2 | v12.34,20.44 v12.35,20.44 | C1.1 4.45,20.16 5.16,20.47 | v2.66,20.71 4.41,21.3 U$5.P$3
  Top 0.457: U3.2 11.15,8.71 11.37,8.89 C10.2 11.74,9.28 11.96,9.47 13.06,9.47 13.27,9.44 | 16.72,20.44 v16.46,20.29 | 7,9.38 v7.01,9.8 | 13.46,8.66 13.89,9.27 13.27,9.44 | 13.27,9.44 v13.46,8.58 | C24.2 21.38,12.16 21.45,12.24 22.66,12.24 | 22.86,12.24 22.66,12.24 | 22.66,12.24 22.25,12.64
  Top 0.508: C21.2 23.57,10.92 23.57,11.45 | C16.1 23.26,19.48 v23.52,19.22 | 23.52,19.3 v23.52,19.91 23.52,19.96 23.37,19.96 23.37,20.31
  Top 0.61: 3.3,18.39 C2.1 | C18.1 24.84,9.2 v25.07,9.14 | C19.1 23.37,20.59
  Top 0.66: C2.1 4.99,20.34
  Top 0.711: C20.2 25.67,21.33 v25.15,21.43 | 4.99,20.34 4.99,21.89 U$5.P$3 | 24.26,17.24 M3.P$1 23.93,17.52 24.82,17.52 24.82,16.91 23.82,16.91 23.82,17.44 | 31.5,13.41 32.18,13.41 32.18,12.09 31.88,12.09 31.5,12.47 31.5,13.3
  Top 0.813: C17.1 25.17,8.11 v25.68,8.2
  Top 1.676: 17.45,12.49 18.39,12.44 | 17.73,12.9 17.91,12.59
  Top 1.778: 11.35,25.88 10.82,27.91
  Bottom 0.127: v20.38,9.89 21.06,10.34 21.13,10.52 21.13,10.87 20.98,11.02 20.88,11.02 arc116 NTC.1
  Bottom 0.203: 13.06,12.64 13.34,13.28 13.34,13.86 v13.11,14.09 12.65,13.63 | U2.P$13 U2.P$14 | C7.2 14.07,12.4 13.97,12.11 | v20.14,8.68 v20.15,8.69
  Bottom 0.254: 13.06,11.93 U2.P$12
  Bottom 0.305: C5.2 3.15,15.6 | U$4.P$2 4.65,14.6 5.26,15.21 v5.26,15.26 | C6.2 3.46,21.41
  Bottom 0.356: R4.1 4.17,9.29 3.73,9.37 v3.15,9.57
  Bottom 0.406: 20.57,9.27 20.47,9.52 20.32,9.88 | 3.46,21.41 2.9,21.4 2.8,21.21 v2.66,20.71
  Bottom 0.457: v3.86,16.63 C4.2 | v20.14,8.68 20.57,9.11 20.57,9.27 | 6.43,18.31 5.74,18.99 5.74,21.38 5.21,21.86
  Bottom 0.508: 13.97,12.11 v14.25,12.54 | 14.28,12.39 14.05,11.58 | C4.2 C5.2 3.17,15.63 | 5.21,21.86 5.1,21.97 U$5.P$3
  Bottom 0.559: v14.28,11.88 14.28,12.39
  Bottom 0.914: v4.85,10.46 4.96,10.09 5.31,10.13 4.95,10.48 4.78,10.18 4.7,10.99 C8.1
  Bottom 1.118: U2.P$13 13.06,11.93 13.06,12.64
  other vias: 24.56,22.47 26.26,22.44 27.64,22.42 28.5,21.83 29.77,21.78 29.13,22.47 30.45,22.44 31.04,21.68 31.8,22.39 32.38,21.48 32.97,22.34 33.56,21.38 26.87,8.07 27.97,8.07 29.21,8.1 30.43,8.07 31.75,8.45 9.58,17.24 7.68,4.45 11.15,4.85 7.8,1.58 9.86,1.58 11.8,1.56 13.99,1.55 9.89,29.02 12.06,28.86 13.84,28.87 16,28.84 16.35,25.87 13.13,25.24 13.5,12.54 5.33,10.03 11.3,16.6 8.99,14.9 9.32,13.86 7.75,18.41 1.4,15.64 1.75,12.36 19.96,18.89 9.53,18.03 10.96,25.26 11.66,25.26 12.36,25.26 11.34,24.58 12.06,24.58 12.81,24.58 13.64,24.61 13.27,4.83 12.57,4.83 11.87,4.83 13.02,5.48 12.32,5.48 11.64,5.48 18.55,21.57 19.25,21.57 18.43,19.54 20.6,9.19 3.25,15.76 6.4,18.38 22.86,12.21 32,9.19 32.54,8.66 23.6,11.48 24.97,17.42 23.75,17.53 24.33,17.16 32.41,11.7 31.88,12.41 31.88,13.1 31.14,13 31.06,13.69 24.89,16.76 23.71,16.88
  pour Route2 (isolate 0.203, no thermals): 0.4,20.72 0.43,9.46 arc-90 2.81,7.1 33.72,7.1 arc-90 36.13,9.51 36.1,9.53 36.1,20.72 arc-90 33.72,23.1 2.78,23.13 arc-90
  pour Route15 (isolate 0.203, rank 2, no thermals): 0.4,20.7 0.4,9.5 arc-90 2.8,7.1 33.7,7.1 arc-90 36.1,9.5 36.1,20.7 arc-90 33.7,23.1 2.8,23.1 arc-90
  pour Route2 (isolate 0.203, no thermals): 7.2,23.1 7.2,29.4 16.6,29.4 16.6,23.1
  pour Route15 (isolate 0.203, no thermals): 7.2,23.1 7.2,29.4 16.6,29.4 16.6,23.1
  pour Route15 (isolate 0.203, rank 2, no thermals): 7.2,7.1 7.2,0.3 16.6,0.3 16.6,7.1
  pour Route2 (isolate 0.203, no thermals): 7.2,7.1 7.2,0.3 16.6,0.3 16.6,7.1
  pour Route3 (isolate 0.203, rank 2, no thermals): 0.37,20.7 0.37,9.5 arc-90 2.77,7.1 33.67,7.1 arc-90 36.07,9.5 36.07,20.7 arc-90 33.67,23.1 2.77,23.1 arc-90
  pour Route3 (isolate 0.203, no thermals): 7.2,23.1 7.2,29.4 16.6,29.4 16.6,23.1
  pour Route3 (isolate 0.203, rank 2, no thermals): 7.2,7.1 7.2,0.3 16.6,0.3 16.6,7.1
  pour Top (isolate 0.178, rank 2): 9.69,29.3 16.7,29.3 16.73,22.8 10.43,22.8 10.41,25.45 10.01,27.14
  pour Top (rank 2, no thermals): 14.39,0.67 14.1,2.05 13.74,4.1 13.45,5.98 7.17,5.98 7.2,1.5 7.2,0.7
  pour Bottom (rank 2, no thermals): 9.4,29.2 16.7,29.2 16.78,22.83 10.8,24.4
  pour Bottom (rank 2, no thermals): 7.4,5.9 14.2,5.9 14.2,0.6 7.4,0.6
  pour Top (isolate 0.203, rank 4): 0.4,20.72 0.43,9.46 arc-90 2.81,7.1 33.72,7.1 arc-90 36.13,9.51 36.1,9.53 36.1,20.72 arc-90 33.72,23.1 2.78,23.13 arc-90
  pour Bottom (isolate 0.203, rank 4): 0.37,20.7 0.37,9.5 arc-90 2.77,7.1 33.67,7.1 arc-90 36.07,9.5 36.07,20.7 arc-90 33.67,23.1 2.77,23.1 arc-90
GND_2  (via drill 0.3, 0.4)
  Top 0.305: U$3.P$4 10.67,37.29 v11.19,37.81
  Bottom 0.305: U10.P$13 10.31,41.47 C15.2 | U10.P$20 15.51,38.79 C14.2
  Bottom 0.33: U10.P$13 10.31,39.65 10.99,38.98 | U10.P$20 13.77,38.79 v12.77,37.78
  Bottom 0.406: 10.99,38.98 11.78,38.98 v11.93,38.8 | U10.P$25 11.94,36.83 v11.93,36.87
  other vias: 7.1,39.74 7.03,37.99 7.05,35.57 9.85,34.2 12.05,34.17 13.9,34.15 15.66,36.11 8.27,35.57
  pour Route15 (isolate 0.203): 6.74,42.51 6.74,33.45 17.14,33.55 17.24,42.51
  pour Route2 (isolate 0.203): 6.72,42.53 6.67,33.53 17.16,33.58 17.16,42.56
  pour Route3 (isolate 0.203): 6.72,42.53 6.67,33.53 17.16,33.58 17.16,42.56
  pour Route14 (isolate 0.203): 6.72,42.53 6.67,33.53 17.16,33.58 17.16,42.56
IN_AP2112
  Top 0.406: U3.1 10.01,7.79 9.63,8.15 9.63,9.21 10.08,9.66 U3.3
  Top 0.457: C10.1 11.75,7.94 B2.1
  Top 0.508: U3.1 11.27,7.77 C10.1
  Top 0.61: 11.59,7.94 C10.1
LED_BLUE
  Top 0.203: R8.1 4.53,11.75 U1.12
LED_GREEN
  Top 0.203: U1.11 4,12.15 3.51,11.63 R7.1
LED_RED
  Top 0.152: 3.5,12.68 3.5,12.19 3.35,12.03 2.85,12.03 2.08,11.27 1.57,11.27 1.35,11.5 1.35,11.96 R6.1
  Top 0.203: 3.5,12.68 U1.10
M1-OUT  (via drill 0.3)
  Top 0.406: M1.P$3 14.88,8 v14.9,9.1
  Bottom 0.203: 10.44,7.31 10.64,7.11 12.52,7.11 12.98,7.51
  Bottom 0.254: U2.P$16 14.17,10.41 | 12.98,7.51 14.43,8.43 14.71,8.66 v14.9,9.1
  Bottom 0.305: 14.17,10.41 14.57,10.41 R3.2
  Bottom 0.356: R5.2 8.01,7.31 10.44,7.31 | 15.09,10.43 15.16,10.31 15.19,9.72 arc-37 v14.9,9.1
  Bottom 0.406: 15.09,10.43 14.66,10.48 14.17,10.41 | 14.6,13.26 14.91,12.95 14.96,11.73 14.96,10.92
  Bottom 0.457: 14.99,10.61 15.09,10.43
  Bottom 0.61: C7.1 14.14,13.31 14.6,13.26 | 14.96,10.92 14.99,10.61
M2-OUT  (via drill 0.4)
  Top 0.203: 31.29,18.87 31.29,18.86 31.14,18.86
  Top 0.711: U$1.P$1 26.85,19.53 C20.1
  Top 1.27: M2.P$8 31.88,18.28 31.29,18.87 31.14,18.86 26.72,18.69 26.24,19.37 U$1.P$1 | 31.77,19.4 30.84,20.24 26.87,20.24
  Bottom 0.203: 31,19.4 31.11,19.29 31.11,18.86 | 31.11,18.86 31.53,19.28 31.53,19.62 | 31.11,18.86 31.14,18.86 v31.89,18.11 v31.9,18.11 | 27,20.2 26.6,19.8 U$1.P$1
  Bottom 1.27: 31.8,17.6 32,17.6 | 32,17.6 35.6,17.6 35.6,18.5 27,18.9 | 27,18.9 27,20.2 34,20.2 35.6,18.6 | 34.2,19.4 31,19.4 | 32,17.6 27,18.9
  other vias: 33.15,18.06 34.43,18.08 35.7,18.06 32.51,17.42 33.75,17.4 35.05,17.37
  pour Top (isolate 0.178, no thermals): 36.14,14.24 30.71,14.24 30.71,17.67 30.48,17.9 26.9,17.9 26.19,18.49 29.08,20.39 29.44,20.75 29.24,20.75 29.18,20.8 36.12,20.7
M3-OUT  (via drill 0.4)
  Top 0.203: 29.85,11.55 30.35,12.06 30.35,12.11
  Top 0.711: C21.1 30.4,10.92 U$2.P$1
  Top 1.27: M3.P$5 29.54,12.75 30.71,11.58 26.49,11.73 26.11,11.42 29.85,11.55 U$2.P$1
  Bottom 0.203: 30.46,11.57 29.57,11.78 | 29.57,11.78 29.9,11.61 | 29.57,11.78 30.35,11 U$2.P$1
  Bottom 1.27: 26,11.2 26,11.1 30.8,11.1 29.7,12.7 29.7,13.5 26.2,13.5 | 26,11.2 26,11.6 30.46,11.57 | 26,11.2 26.1,13.3 26.6,12.6 29,12.6
  other vias: 25.97,13.3 27.33,13.27 28.55,13.25 29.86,13.3 26.66,13.83 27.93,13.83 29.22,13.83
  pour Top (no thermals): 25.55,17.57 30.38,17.57 30.38,14.17 arc45 31.47,11.55 25.55,11.55
M4-OUTA
  Top 0.406: M4.P$7 22.36,10.03 22.71,10.13
  Top 0.457: 22.71,10.13 25.15,10.13 26.47,8.81 29.91,8.81 R13.2
M4-OUTA-IN
  Top 0.457: R13.1 30.91,9.19 33.15,11.43 M2.P$2
M4-OUTB
  Top 0.406: 21.69,8.53 21.69,8.54 M4.P$5
  Top 0.457: 21.69,8.53 21.69,8.02 22.45,7.26 28.55,7.26 R14.2
M4-OUTB-IN
  Top 0.457: R14.1 29.78,7.36 32.44,7.36 35.69,10.61 M2.P$4
M5-OUTA
  Top 0.305: M5.P$7 20.92,21.14
  Top 0.508: 20.92,21.14 21.87,21.38 24.13,21.38 arc90 R15.2
M5-OUTA-IN
  Top 0.457: R15.1 24.2,18.91 23.04,17.75 23.04,16.43 23.5,15.97 M3.P$2
M5-OUTB  (via drill 0.3, 0.4)
  Top 0.203: M5.P$5 20.22,19.79
  Top 0.406: 20.22,19.79 M5.P$5 20.3,19.63
  Top 0.457: R16.2 23.23,12.85 v23.01,12.87
  Top 0.61: 20.3,19.63 20.65,19.27 v20.65,19.07
  Bottom 0.457: v23.01,12.87 22.94,12.97 22.94,13.38 arc54 20.78,17.65 20.65,17.77 v20.65,19.07
M5-OUTB-IN
  Top 0.457: R16.1 24.66,12.97 M3.P$4
MPM3610_AGND
  Bottom 0.254: R1.1 11.44,8.39 11.25,8.63 U2.P$3
MPM3610_EN
  Bottom 0.254: U2.P$17 14.19,9.91
  Bottom 0.305: 14.19,9.91 14.37,9.8 R3.1
MPM3610_FB
  Bottom 0.254: U2.P$1 12.55,8.24 | R2.1 10.99,7.75 11.2,7.51 12.32,7.51 12.49,7.86 R1.2
  Bottom 0.305: 12.55,8.24 R1.2
MPM3610_SW
  Bottom 0.356: 10.54,9.09 10.57,8.99 U2.P$4
  Bottom 0.61: U2.P$5 10.11,9.35 10.11,9.09 10.54,9.09
  Bottom 1.118: U2.P$6 9.22,9.42 8.94,9.95 10.19,9.95 9.86,9.34 9.32,9.34 9.39,9.41 U2.P$5
N$1
  Top 0.203: RGB.P$4 0.76,10.6 R6.2
N$4
  Top 0.203: R7.2 3.6,9.95 RGB.P$3
N$5
  Top 0.203: R8.2 5.48,9.13 RGB.P$2
N$17
  Bottom 0.305: U10.P$21 15.6,38.14 R17.1
OUT_MPM3610  (via drill 0.4)
  Top 0.305: B2.2 12.77,7.16
  Top 0.356: 12.77,7.16 9.42,7.16 8.94,7.64 v8.94,8.22
  Bottom 0.305: v8.94,8.22 8.79,8.35 8.52,8.26
  Bottom 0.356: 10.16,12.24 10.56,12.25 U2.P$9
  Bottom 0.61: R2.2 8.79,8.12 8.52,8.26 7.8,8.88 7.8,10.73 U2.P$7
  Bottom 0.813: 8,11.93 C8.2
  Bottom 1.016: 10.31,12.34 9.42,12.36 10.16,12.24
  Bottom 1.118: 9.12,12.14 9.39,12.28 8,11.93 | 9.12,12.14 9.02,12.19 10.16,12.24 | 10.16,12.24 10.31,12.34 | 10.16,12.24 U2.P$8 | U2.P$7 9.21,12.05 9.12,12.14
PWM-1  (via drill 0.3)
  Top 0.203: M5.P$4 17.2,19.79 16.28,18.87 15.54,18.87 15.32,18.64 14.48,18.64 11.94,16.1 v11.79,16.1 | U1.18 7.22,13.81 v8.69,13.81
  Bottom 0.203: v11.79,16.1 11.61,16.1 11.07,15.57 10.59,15.57 9.37,14.34 9.07,14.34 8.69,13.96 v8.69,13.81
PWM-2  (via drill 0.3)
  Top 0.203: M5.P$2 16.34,21.09 14.76,19.5 13.44,19.5 v10.62,16.68 | U1.21 7.22,15.39 9.42,15.39 v9.53,15.29
  Bottom 0.203: v10.62,16.68 10.62,16.35 9.55,15.29 v9.53,15.29
PWM-3
  Top 0.203: U1.19 11.02,14.35 12.06,13.3 12.06,11.96 13.54,10.48 15.82,10.48 17.68,8.63 18.78,8.63 M4.P$4
PWM-4
  Top 0.203: U1.22 9.75,15.85 10.79,14.8 11.15,14.8 12.98,12.95 12.98,12.26 13.92,11.35 16.18,11.35 16.48,11.04 17.53,10.1 18.76,10.1 M4.P$2
RS485_N  (via drill 0.3)
  Top 0.178: v20.78,7.71 20.91,7.6 20.76,7.45 16.24,7.45 15.43,6.64 11.49,6.64 9.73,4.52 v9.58,4.59 | v15.19,22.12 15.33,22.12 15.33,22.01 14.93,21.64 14.38,21.64 14.24,21.74 U5.P$7
  Bottom 0.178: v20.78,7.71 20.91,7.6 21.45,8.67 arc44 21.71,9.8 arc-19 21.71,11.53 21.85,12.42 21.86,12.5 arc64 20.39,16.71 arc-43 19.09,19 arc-14 19.09,19.1 arc38 18.79,20.06 arc54 16.18,21.42 15.81,21.42 15.35,21.87 15.35,22.03 arc117 v15.19,22.12 | U$8.P$3 10.9,3.3 v9.58,4.59 | 15.35,22.14 v15.19,22.12 | U$9.P$3 13.73,26.47 13.73,26.11 arc41 14.18,24.9 arc-29 15.35,22.52 15.35,22.12 v15.19,22.12
RS485_P  (via drill 0.3)
  Top 0.178: U$8.P$4 8.9,2.96 11.65,6.31 15.56,6.31 16.38,7.12 20.91,7.12 21.22,7.43 v21.37,7.38 | v15.85,22.08 15.68,22.07 15.68,21.9 15.08,21.29 14.41,21.29 14.21,21.09 U5.P$6
  Bottom 0.178: v21.37,7.38 21.21,7.41 21.73,8.49 arc44 22.03,9.85 arc-19 22.04,11.47 22.18,12.37 22.18,12.43 arc64 20.6,16.96 arc-43 19.42,19.04 arc0 19.42,19.09 arc38 19.06,20.26 arc54 16.18,21.75 15.94,21.75 15.82,21.87 v15.85,22.08 | 15.68,22.07 v15.85,22.08 | U$9.P$4 14.06,26.46 14.06,26.11 arc41 14.43,25.12 arc-29 15.69,22.58 15.69,22.06 v15.85,22.08
SEL_SERIAL
  Top 0.203: U1.28 5.03,17.9 6.02,18.89 9.35,18.89 10.26,19.81 10.26,20.85 10.02,21.09 9.37,21.09 U5.P$3 | U5.P$3 9.4,21.09 | R20.1 8.24,20.58 8.76,21.1 8.91,21.1 | 8.91,21.1 9.32,21.1 U5.P$3 | U5.P$2 9.07,21.74 8.91,21.58 8.91,21.1
SPI_CLK  (via drill 0.3)
  Top 0.152: U1.9 2.88,12.7 1.91,11.73 v1.83,11.73
  Bottom 0.152: v1.83,11.73 1.91,11.73 3.5,13.33 3.5,13.96 3.64,14.1 U$4.P$1
SPI_CLK_2  (via drill 0.3)
  Top 0.203: U$3.P$5 8.85,36.79 v8.31,36.25
  Bottom 0.203: U10.P$10 arc55 8.75,37.83 R19.2 8.23,36.33 v8.31,36.25
SPI_IN  (via drill 0.3)
  Top 0.203: U1.7 arc-90 2.37,13.84 1.88,13.84 1.68,13.63 v1.4,13.63
  Bottom 0.127: 3.43,15.21 3.63,15.41 3.79,15.6 U$4.P$4
  Bottom 0.152: v1.4,13.63 1.55,13.63 3,15.08 3.12,15.08 3.43,15.21
SPI_IN_2  (via drill 0.3)
  Top 0.178: U$3.P$2 9.54,38.29 v8.24,39.2
  Bottom 0.178: v8.24,39.2 8.23,39.22 R18.2
  Bottom 0.203: R18.2
  Bottom 0.305: U10.P$11 8.46,38.79 R18.2
SPI_OUT  (via drill 0.3)
  Top 0.203: U1.8 1.9,13.35 v1.52,12.97
  Bottom 0.152: v1.52,12.97 1.68,12.97 3.8,15.1 U$4.P$3 4.59,15.1 4.75,15.26 4.75,15.97 4.93,16.15 6.1,16.15 6.33,15.92 U$6.P$2
SPI_OUT_2  (via drill 0.3)
  Top 0.178: v9.38,40.04 8.21,40.04 7.55,39.38 7.55,38.39 8.31,37.79 U$3.P$3
  Bottom 0.178: U10.P$12 v9.38,40.04
SWCLK  (via drill 0.3)
  Top 0.203: U1.24 7.54,16.85 7.54,17.27 7.19,17.62 7.19,18.28 v7.09,18.38
  Bottom 0.203: v7.09,18.38 6.27,19.2 6.27,22.25 6.32,22.3 U$5.P$2
SWDIO  (via drill 0.3)
  Top 0.203: U1.23 7.69,16.35 7.95,16.61 7.95,17.72 v7.9,17.77
  Bottom 0.203: v7.9,17.77 7.87,17.75 6.25,17.75 5.23,18.77 5.23,20.87 4.88,21.15 4.22,21.71 3.83,22.1 U$5.P$4
USART1_RX
  Top 0.203: U1.30 4.03,18.43 6.62,20.99 7.85,20.99 8.51,21.65 8.51,22.11 8.79,22.4 U5.P$1
USART1_TX
  Top 0.203: U1.29 4.53,18.16 5.74,19.38 8.46,19.38 9.34,20.25 U5.P$4
V_BAT  (via drill 0.3)
  Top 0.178: 6.03,12.27 5.89,12.11 5.89,11.5 v6.1,11.27
  Top 0.203: 6.03,11.34 v6.1,11.27 | U1.15 6.03,12.27
  Bottom 0.254: 6.06,8.24 6.35,8.53 6.35,11.02 v6.1,11.27
  Bottom 0.356: R5.1 6.06,8.24
  Bottom 0.406: R4.2 R5.1
V_CORRIENTE  (via drill 0.3)
  Top 0.203: U1.14 5.53,11.13 5.61,11.04 5.89,10.76 6.07,10.76 7.49,10.76 8.87,12.14 8.87,13 v9.09,13.23 | v11.76,15.36 12.11,15.36 C11.1 13.26,14.78 13.71,14.32 R10.1
  Bottom 0.203: v11.76,15.36 9.65,13.25 9.12,13.25 v9.09,13.23
V_TEMP  (via drill 0.3)
  Top 0.203: U1.13 5.03,11.09 5.74,10.38 8.19,10.38 9.52,11.71 R9.1 9.8,12.28 9.8,13.28 10.34,13.81 10.9,13.81 11.43,13.28 11.43,11.55 13.01,9.98 13.84,9.88 15.67,9.88 17.58,7.97 v20.14,7.97
  Bottom 0.203: NTC.2 arc-90 21.11,9.78 21.11,8.94 v20.14,7.97
VDDA-FILTRADO  (via drill 0.3)
  Top 0.254: B1.1 1.49,14.85 U1.5
  Top 0.305: B1.1 1.08,15.11 v1.52,14.98
  Bottom 0.508: C4.1 C5.1 2.14,15.34 1.78,14.98 v1.52,14.98
VMOT  (via drill 0.3)
  Top 0.406: M5.P$6 21.03,20.44 | M4.P$6 23.28,9.38 C18.2
  Top 0.457: C24.1 22.05,14.7
  Top 0.483: 21.03,20.44 21.03,20.42
  Top 0.508: 21.39,19.93 C19.2 21.26,20.42 | C18.2 23.39,8.83 23.11,8.55 23.11,9.16 22.99,9.16 22.99,8.76 v22.71,8.76
  Top 0.559: 20.68,15.06 20.76,15.09 20.85,15.39
  Top 0.61: 21.03,20.42 21.39,19.93 | v22.81,8 23.02,8.07 C17.2 | M3.P$3 22.05,14.7 21.14,14.7 20.76,15.09 | M2.P$3 34.42,11.07 v33.76,11.02
  Top 0.711: C16.2 21.77,20.52 21.13,20.39 21.26,20.42
  Top 0.813: C16.2 21.51,18.61 19.09,16.64 19.24,16.57 U4.P$3
  Top 1.321: 19.24,16.57 19.79,16.28
  Top 1.626: 19.79,16.28 20.22,15.72
  Top 1.651: 20.22,15.72 20.68,15.06
  Bottom 0.508: v22.71,8.76 22.68,8.76
  other vias: 24.71,14.35 23.55,14.37 24.71,15.03 23.52,15.03 22.48,18.13 22.02,18.69 21.31,18.59 21.79,17.98 22.33,17.37 24.13,14.7 34.09,13.3 34.75,13.33 34.42,12.69 34.09,12.08 34.77,12.08 35.03,11.04 34.42,10.51 34.42,11.42 21.44,13.51 18.69,17.09 18.31,18.1 21.36,14.17 18.87,17.75
  pour Top (isolate 0.178, rank 2, no thermals): 16.33,16.28 16.33,18.38 21.13,18.38 21.41,19.3 21.41,19.32 23.32,19.37 23.24,15.82 23.24,15.74 25.3,15.74 25.25,13.74 23.47,13.51 20.98,12.64 19.81,12.64 19.76,13.63 18.75,16.28
  pour Bottom (isolate 0.178, no thermals): 21.07,17.93 21.03,19.45 23.22,18.99 23.5,18.79 36.2,18.2 36.2,9.3 35.3,9.3 34.1,8.6 33.7,7 22.3,7.1 22.7,16.3 22.01,16.8
  pour Route14 (isolate 0.203, rank 2, no thermals): 18.09,7.18 33.54,7.11 33.74,7.16 33.85,7.96 34.4,8.8 35.4,9.3 36.2,9.3 36.2,18.26 34.85,18.26 26.11,18.18 25.43,18.84 21.97,19.78 21.06,18.82 17.98,18.84
  pour Top (isolate 0.178, rank 2, no thermals): 33.3,11.09 33.3,11.04 34.26,10.08 34.67,10.08 35.33,10.74 35.33,13.05 35.74,13.46 35.74,13.96 33.15,13.96 33.15,11.09

### Text on the board
tNames: M5 | M2 | U1 | U4 | M3 | U3 | RGB | M4
bNames: U10 | U2
tDocu: <-8.15mm-> | FFC-0.5 | 2mm-> | <-7.4mm-> | +5V | GND | B | A | SWDIO | GND | CLK | 3V3 | GND | A | B | +5V
bDocu: +5V | GND | B | A | 8MHz | FFC-0.5 | GND | 3V3 | POT | A | B | GND | +5V | JLCJLCJLCJLC